# Altium schematic sheet UART.SchDoc
size A
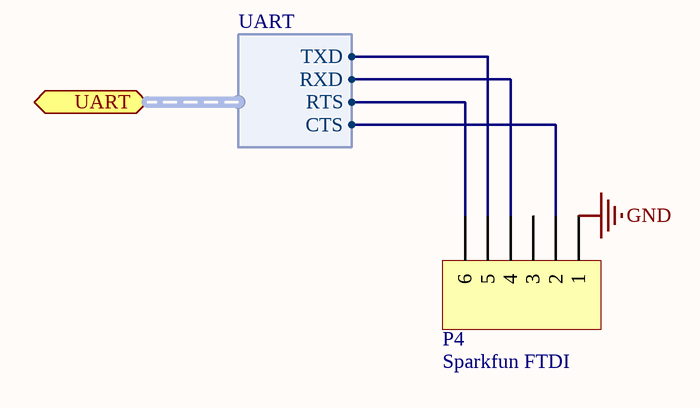
[diagram p0: UART.SchDoc]

## Parts
P4  Sparkfun FTDI  [HDR1X6]

## Ports
UART (harness UART)

## Harnesses
UART: CTS, RTS, RXD, TXD

## Nets
GND: P4.1
NetP4_2: P4.2 ; port UART.CTS
NetP4_4: P4.4 ; port UART.RXD
NetP4_5: P4.5 ; port UART.TXD
NetP4_6: P4.6 ; port UART.RTS

Not connected (* = marked no-connect by the designer): P4 3

## Library data of the parts
P4 = Header 6: Header, 6-Pin; LatestRevisionDate: 17-Jul-2002; LatestRevisionNote: Re-released for DXP Platform.; Publisher: Altium Limited